# EAGLE design Reg (EAGLE 9.6.2)
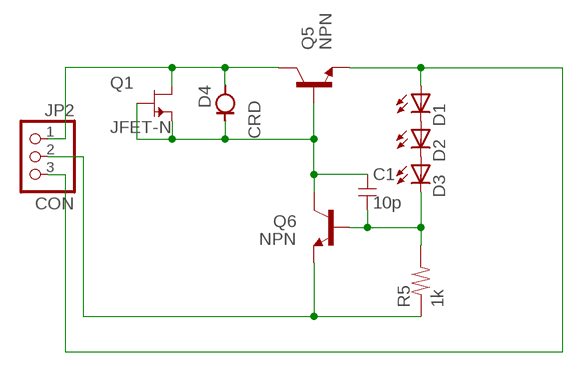
[diagram p0: schematic, sheet 1]

## Parts
C1  10p  C-1608  [1608]
D1  LED-SMD2012  [D2012]
D2  LED-SMD2012  [D2012]
D3  LED-SMD2012  [D2012]
D4  CRD  CRD-SMD  [SOD123]
JP2  CON  SW-1X3  [1X03]
Q1  JFET-N  [SC59]
Q5  NPN  NPN2SC3422-2  [TO126-2]
Q6  NPN  NPN2SC3325  [SC59]
R5  1k  R-1608  [1608]

## Nets
GND1: JP2.2 Q6.2(E) R5.1
IN1: D4.1(A) JP2.1 Q1.2(D) Q5.2(C)
N$1: D1.K D2.A
N$2: D2.K D3.A
N$12: C1.1 D4.2(K) Q1.1(S) Q1.3(G) Q5.3(B) Q6.3(C)
N$13: C1.2 D3.K Q6.1(B) R5.2
OUT1: D1.A JP2.3 Q5.1(E)

## Library data of the parts
C1 = my_rcl:C
D1-D3 = my_rcl:LED
D4 = my_rcl:CRD
JP2 = my_connector:SW-1X3: PIN HEADER
Q1 = my_ic:JFET-N
Q5 Q6 = my_ic:NPN
R5 = my_rcl:R

## Board
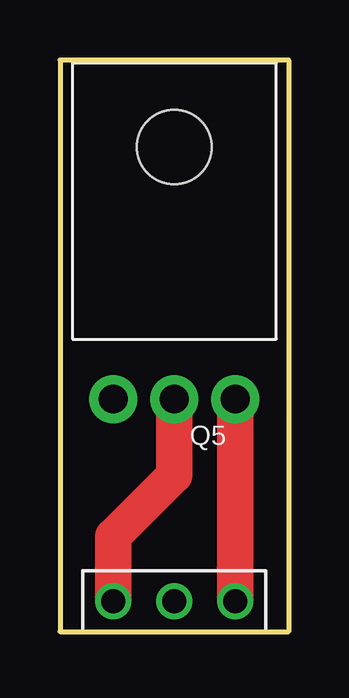
[diagram p1: board, top side]
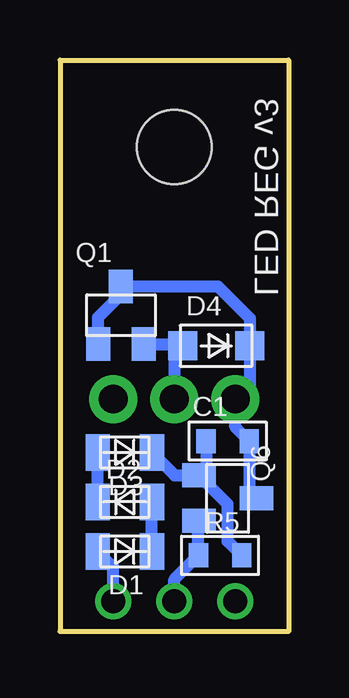
[diagram p2: board, bottom side, seen from below]

Size 9.53 x 23.81 mm. Coordinates in mm from the lower left corner, seen from the top.
Outline: 0,0 9.53,0 9.53,23.81 0,23.81 0,0
Copper layers (1*16): Top 0.035mm / dielectric 1.5mm / Bottom 0.035mm
Design rules "SeeedStudio_2layer_DRU_20140221 *": minimum track width 6mil, minimum drill 0.4mm, track to track 8mil, track to pad 8mil, pad to pad 8mil, via to via 12mil, smd to smd 0mil, copper to edge 0.3mm, drill to drill 10mil, minimum pad ring 8mil, minimum via ring 8mil, stop-mask expansion 2mil, vias tented up to drill 1mm, thermal gap 10mil

### Footprints (pad centres in the part's own frame; a part is rotated, then mirrored left to right if it is on the bottom)
1608 = smd 0.8 x 1: 1 -0.9,0; 2 0.9,0
D2012 = smd 1.016 x 1.524: A 1.127,0; K -1.127,0
SOD123 = smd 1.2 x 1.2: 1 -1.4,0; 2 1.4,0
1X03 = drill 1: 1 -2.54,0; 2 0,0; 3 2.54,0
SC59 = smd 1 x 1.4: 1 -0.95,-1.2; 2 0.95,-1.2; 3 0,1.2
TO126-2 = drill 1.2 pad 2: 1 2.54,0; 2 0,0; 3 -2.54,0 | hole 3.1: 0,10.5

### Placement (x,y rotation side)
C1  2.54,7.94 180 bottom
D1  6.83,3.33 180 bottom
D2  6.83,5.4 0 bottom
D3  6.83,7.46 180 bottom
D4  3.02,11.91 0 bottom
JP2  4.76,1.27 0 top
Q1  6.99,13.18 0 bottom
Q5  4.76,9.68 0 top
Q6  2.54,5.56 270 bottom
R5  2.86,3.17 0 bottom

### Tracks (layer width: path | path; a pad name or v marks a point on that pad's centre or on a via)
GND1
  Bottom 0.508: JP2.2 4.76,2.17 R5.1 3.76,4.59 Q6.2
IN1
  Top 1.524: Q5.2 4.76,6.51 2.22,3.97 JP2.1
  Bottom 0.508: Q5.2 4.76,11.56 D4.1 4.49,11.98 Q1.2
N$1
  Bottom 0.508: D1.K D2.A
N$2
  Bottom 0.508: D2.K D3.A
N$12
  Bottom 0.508: Q1.1 7.93,13.09 6.99,14.04 Q1.3 2.95,14.38 1.62,13.05 D4.2 1.62,10.29 Q5.3 2.22,8.52 C1.1 1.64,5.86 Q6.3
N$13
  Bottom 0.508: D3.K 4.74,6.51 Q6.1 | R5.2 2.54,3.76 2.54,5.31 Q6.1 | C1.2 3.44,6.81 Q6.1
OUT1
  Top 1.524: JP2.3 Q5.1
  Bottom 0.508: JP2.3 7.3,2.68 D1.A

### Text on the board
bPlace: LED REG v3